# EasyEDA schematic schematic.json
TITLE: Ugly RC Car; REV: 1.0; Date: 2019-12-22; Sheet: 1/1; Drawn By: Alexandre Calil
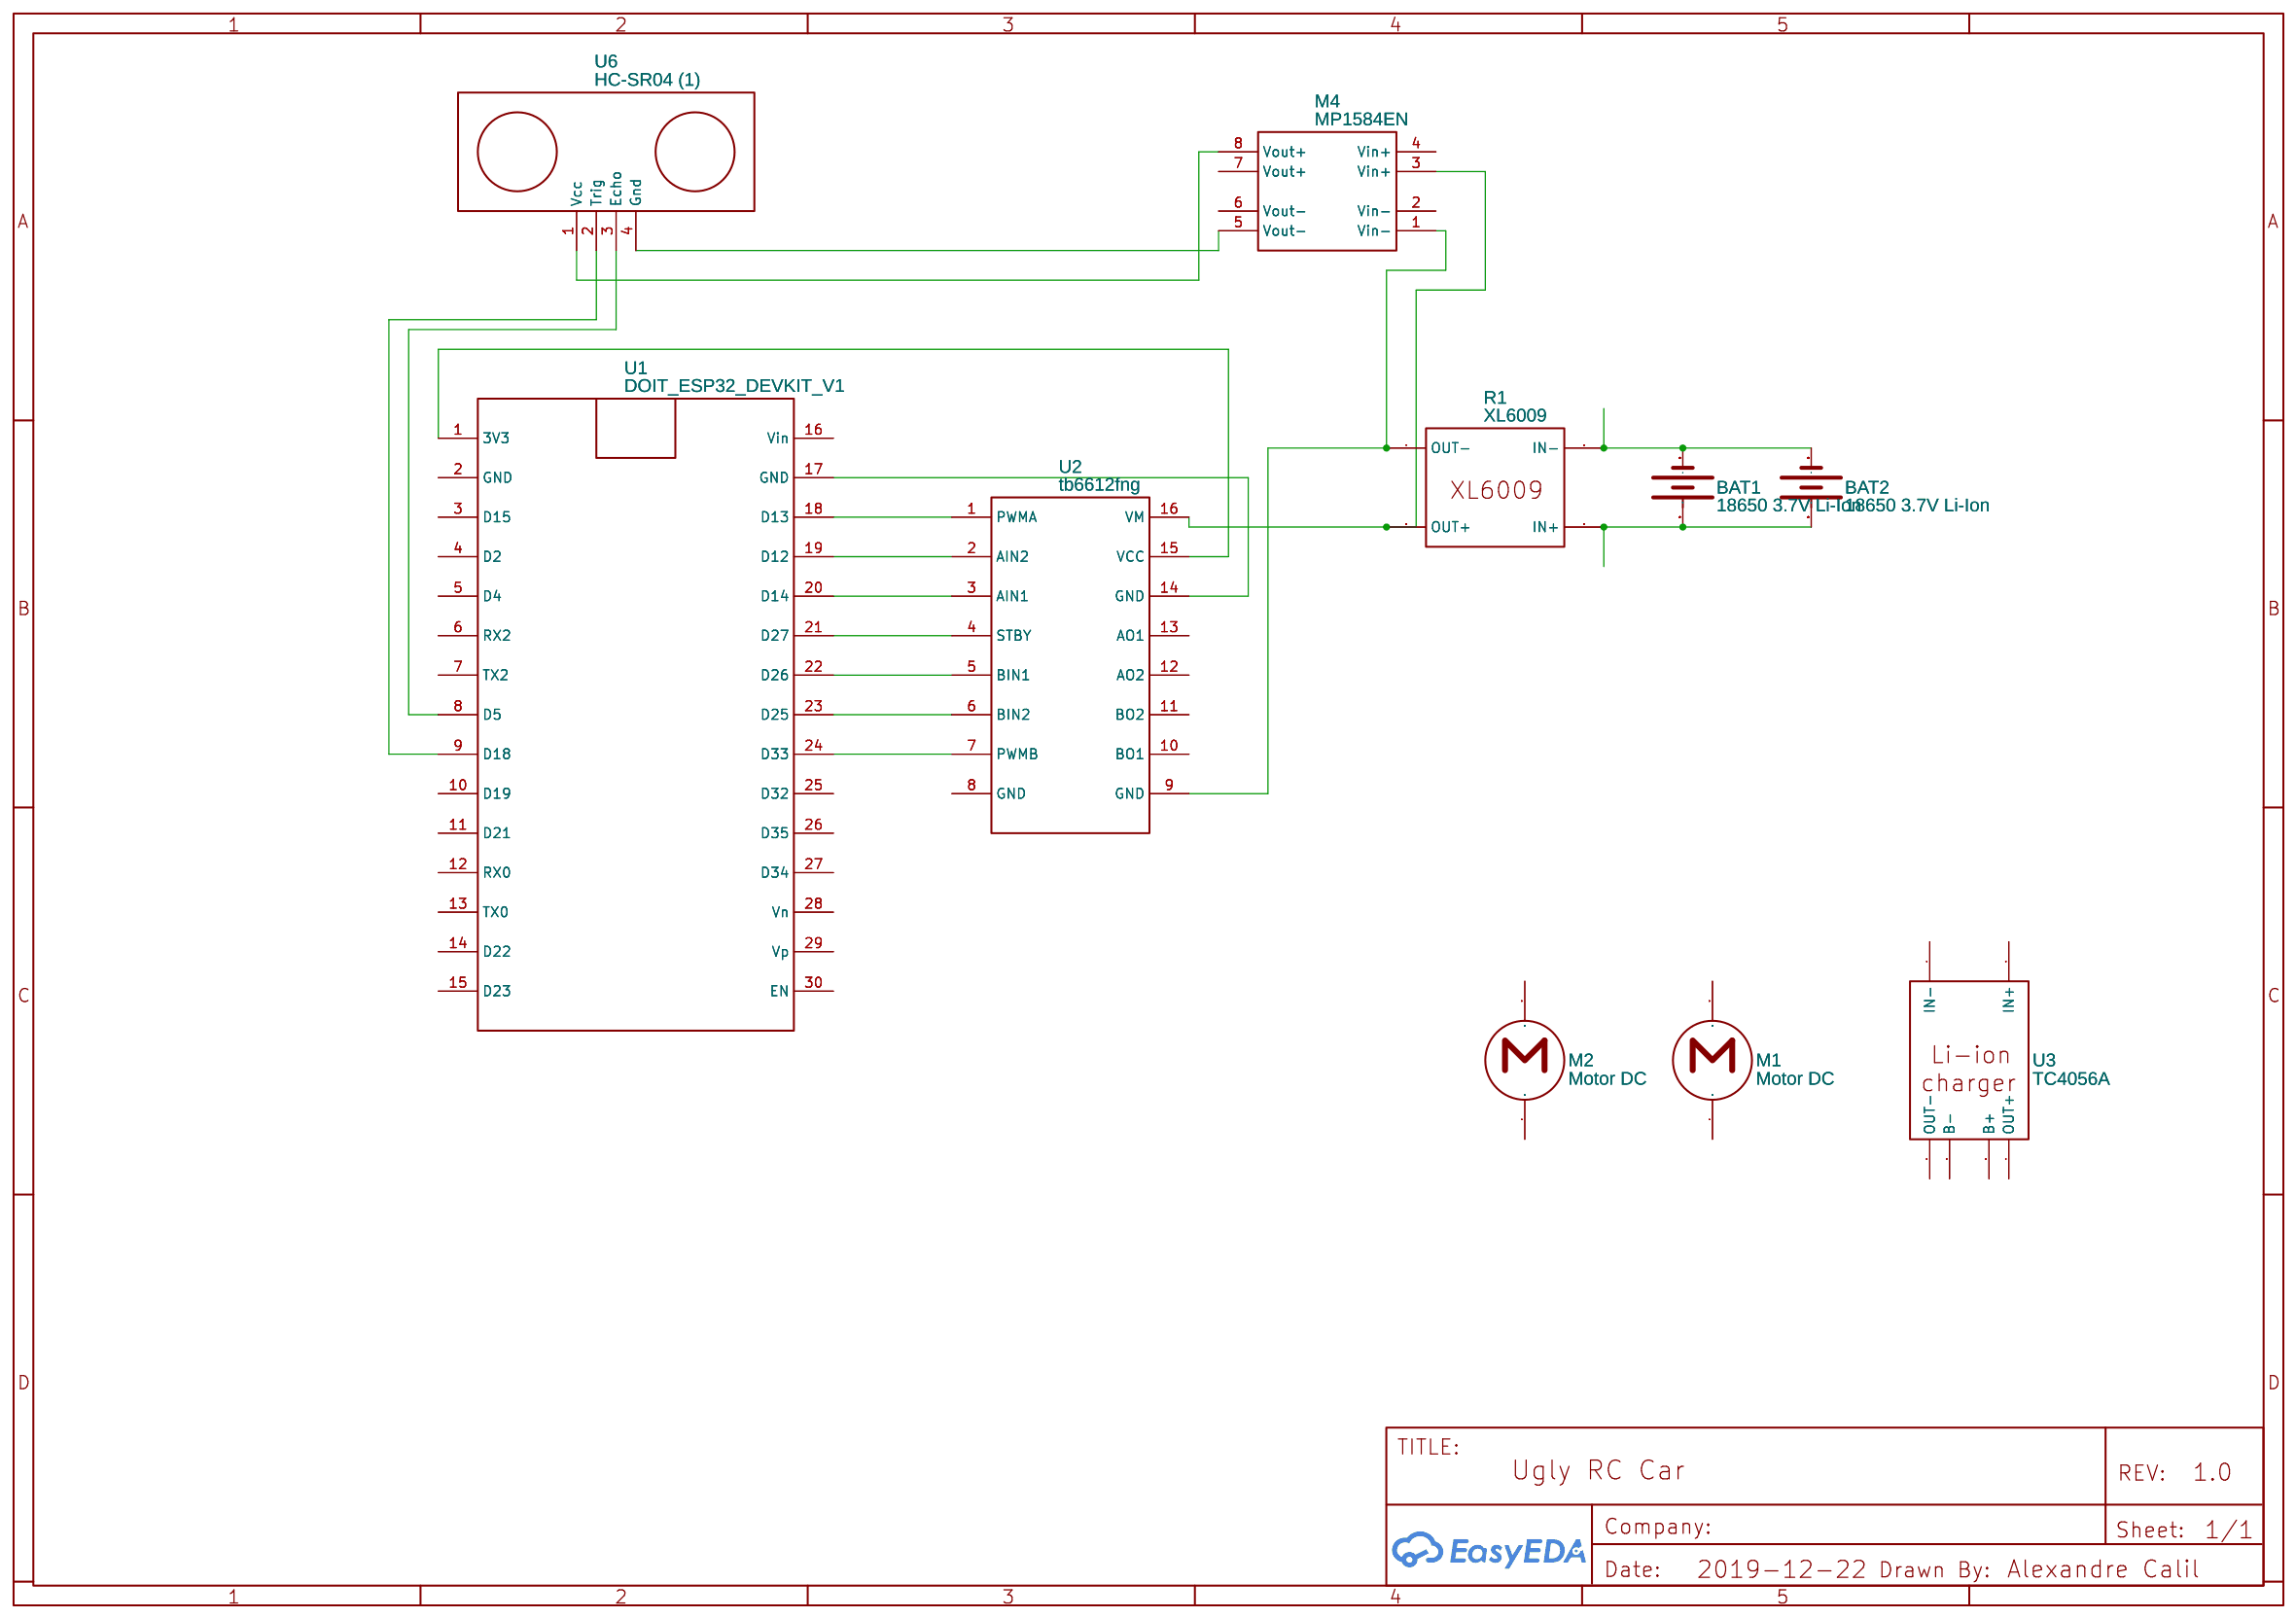
[diagram p0: schematic sheet]

## Parts
BAT1  18650 3.7V Li-Ion  [18650 LI-ION ONBOARD PLASTIC HOLDER]
BAT2  18650 3.7V Li-Ion  [18650 LI-ION ONBOARD PLASTIC HOLDER]
M1  Motor DC
M2  Motor DC
M4  MP1584EN  [MP1584EN]
R1  XL6009  [XL6009]
U1  DOIT_ESP32_DEVKIT_V1  [DOIT_ESP32]
U2  tb6612fng  [TB6612FNG]
U3  TC4056A
U6  HC-SR04 (1)  [4 PIN HEADER HC-SR04 45MM]

## Library data of the parts
BAT1 BAT2 = -: Supplier Part: undefined; Contributor: RomanKaban
M1 M2 = -: Contributor: monet
M4 = -: Contributor: mchahn
R1 = XL6009: Contributor: marat.ashirov
U1 = -: Manufacturer Part: DOIT ESP32 DEVKIT V1; Contributor: judas666
U2 = -: Contributor: Luz Aguirre
U3 = TC4056A_Li_ion_charger: Contributor: brandon3055
U6 = -: Manufacturer Part: HC-SR04; Contributor: Slowhand

## Nets
Net-(BAT1-GND@1): BAT1.GND@1(-) BAT2.GND@1(-) R1.2(IN-)
Net-(BAT1-PWR@1): BAT1.PWR@1(+) BAT2.PWR@1(+) R1.1(IN+)
Net-(M4-1): M4.1(Vin-) R1.4(OUT-) U2.9(GND)
Net-(M4-3): M4.3(Vin+) R1.3(OUT+) U2.16(VM)
Net-(M4-5): M4.5(Vout-) U6.4(Gnd)
Net-(M4-8): M4.8(Vout+) U6.1(Vcc)
Net-(U1-1): U1.1(3V3) U2.15(VCC)
Net-(U1-8): U1.8(D5) U6.3(Echo)
Net-(U1-9): U1.9(D18) U6.2(Trig)
Net-(U1-17): U1.17(GND) U2.14(GND)
Net-(U1-18): U1.18(D13) U2.1(PWMA)
Net-(U1-19): U1.19(D12) U2.2(AIN2)
Net-(U1-20): U1.20(D14) U2.3(AIN1)
Net-(U1-21): U1.21(D27) U2.4(STBY)
Net-(U1-22): U1.22(D26) U2.5(BIN1)
Net-(U1-23): U1.23(D25) U2.6(BIN2)
Net-(U1-24): U1.24(D33) U2.7(PWMB)

Not connected (* = marked no-connect by the designer): M1 1 2; M2 1 2; M4 2(Vin-) 4(Vin+) 6(Vout-) 7(Vout+); U1 2(GND) 3(D15) 4(D2) 5(D4) 6(RX2) 7(TX2) 10(D19) 11(D21) 12(RX0) 13(TX0) 14(D22) 15(D23) 16(Vin) 25(D32) 26(D35) 27(D34) 28(Vn) 29(Vp) 30(EN); U2 8(GND) 10(BO1) 11(BO2) 12(AO2) 13(AO1); U3 1(IN+) 2(B-) 3(B+) 4(IN-)
